# Altium schematic sheet Power.SchDoc
size A
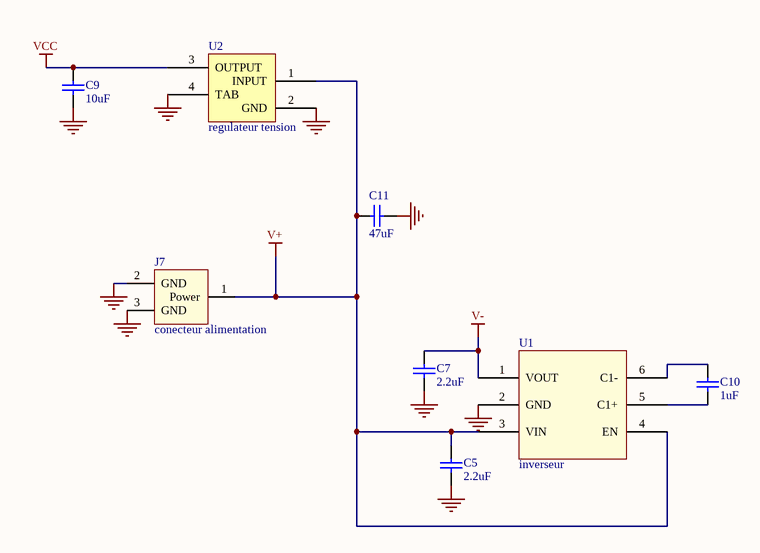
[diagram p0: Power.SchDoc]

## Parts
C5  2.2uF  [CAPC1608X09N]
C7  2.2uF  [CAPC1608X09N]
C9  10uF  [CAPC1608X09N]
C10  1uF  [CAPC1608X09N]
C11  47uF  [CAPC1608X09N]
J7  conecteur alimentation
U1  inverseur
U2  regulateur tension  [SOT230P710X180-4N]

## Nets
GND: C5.1 C7.1 C9.1 C11.1 J7.2(GND) J7.3(GND) U1.2(GND) U2.2(GND) U2.4(TAB)
V+: C5.2 C11.2 J7.1(Power) U1.3(VIN) U1.4(EN) U2.1(INPUT)
V-: C7.2 U1.1(VOUT)
VCC: C9.2 U2.3(OUTPUT)
NetC10_1: C10.1 U1.6(C1-)
NetC10_2: C10.2 U1.5(C1+)

## Library data of the parts
C5 C7 C9-C11 = Cap: Capacitor; Value: 0.1uf; Published: 8-Jun-2000; LatestRevisionDate: 17-Jul-2002; LatestRevisionNote: Re-released for DXP Platform.; PackageReference: RAD-0.3; Publisher: Altium Limited; PackageDescription: Radial Cap, Thru-Hole; 2 Leads; 0.3 in Pin Spacing
U2 = regulateur tension: fournisseur: farnell; Ref fournisseur: 2510013; Ref fabricant: MIC2920A-3.3WS-TR